# EAGLE design EMG_Final (EAGLE 8.3.2)
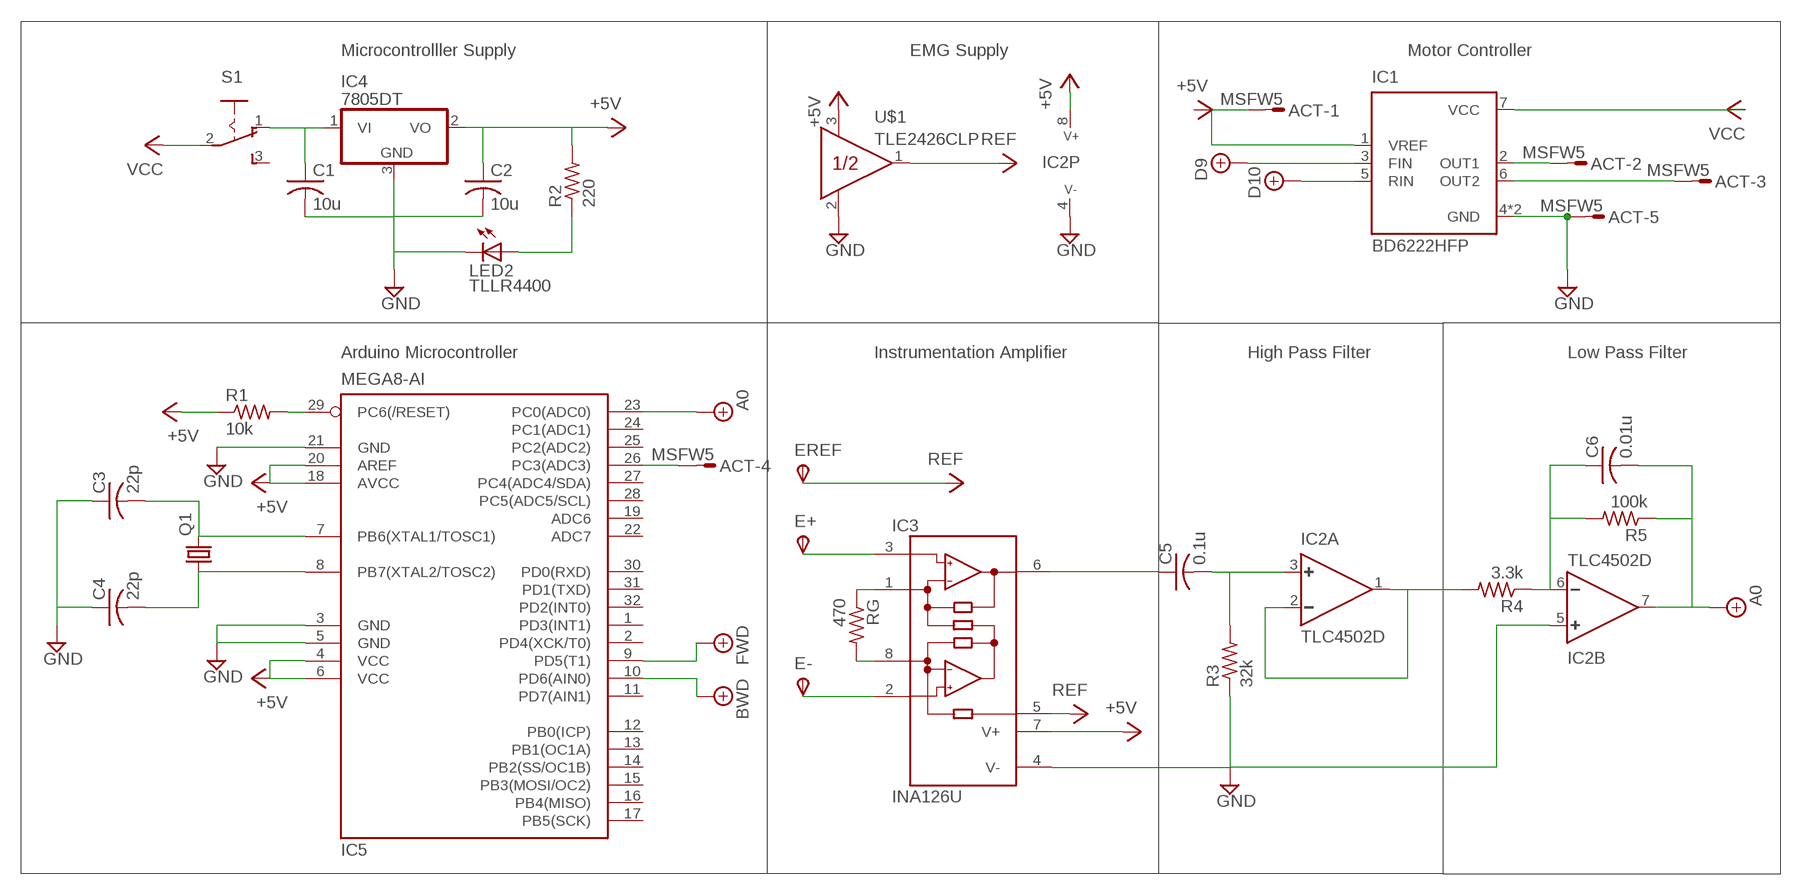
[diagram p0: schematic, sheet 1]

## Parts
ACT  MSFW5  [MSFW5]
C1  10u  C-USC0603  [C0603]
C2  10u  C-USC0603  [C0603]
C3  22p  C-USC0603  [C0603]
C4  22p  C-USC0603  [C0603]
C5  0.1u  C-USC0603  [C0603]
C6  0.01u  C-USC0603  [C0603]
E+  TPSPAD1-13  [P1-13]
E-  TPSPAD1-13  [P1-13]
EREF  TPSPAD1-13  [P1-13]
IC1  BD6222HFP  [HRP7]
IC2  TLC4502D  [D_R-PDSO-G08]
IC3  INA126U  [SO08]
IC4  7805DT  [TO252]
IC5  MEGA8-AI  [TQFP32-08]
LED2  TLLR4400  [LED3MM]
Q1  CRYSTALMM20SS  [MM20SS]
R1  10k  R-US_R0603  [R0603]
R2  220  R-US_R0603  [R0603]
R3  32k  R-US_R0603  [R0603]
R4  3.3k  R-US_R0603  [R0603]
R5  100k  R-US_R0603  [R0603]
RG  470  R-US_R0603  [R0603]
S1  255SB  [255SB]
U$1  TLE2426CLP  [TO226AA]

## Nets
+3V3: EREF.TP(PP) IC3.5(REF) U$1.1(OUT) ; supply symbol labelled REF
+5V: C2.1 IC2.8(P:V+) IC3.7(V+) IC4.2(VO) IC5.4(VCC) IC5.6(VCC) IC5.18(AVCC) IC5.20(AREF) R1.1 R2.2 U$1.3(IN)
+5V/1: C6.2 IC2.7(B:OUT) IC5.23(PC0(ADC0)) R5.1 ; supply symbol labelled A0
+10V: IC1.3(FIN) IC5.9(PD5(T1)) ; supply symbol labelled D9, FWD
+12V: IC1.5(RIN) IC5.10(PD6(AIN0)) ; supply symbol labelled D10, BWD
GND: ACT.5 C1.2 C2.2 C3.1 C4.1 IC1.4(GND) IC1.P(GND) IC2.4(P:V-) IC2.5(B:+) IC3.4(V-) IC4.3(GND) IC5.3(GND) IC5.5(GND) IC5.21(GND) LED2.K(C) R3.1 U$1.2(COM)
N$1: C1.1 IC4.1(VI) S1.1(O)
N$2: C3.2 IC5.7(PB6(XTAL1/TOSC1)) Q1.4
N$3: C4.2 IC5.8(PB7(XTAL2/TOSC2)) Q1.1
N$4: IC5.29(PC6(/RESET)) R1.2
N$5: LED2.A R2.1
N$6: C5.1 IC3.6(OUT)
N$7: C5.2 IC2.3(A:+) R3.2
N$8: IC2.1(A:OUT) IC2.2(A:-) R4.2
N$9: C6.1 IC2.6(B:-) R4.1 R5.2
N$10: ACT.1 IC1.1(VREF)
N$11: IC3.8(RG) RG.2
N$12: IC3.1(RG) RG.1
N$13: ACT.2 IC1.2(OUT1)
N$14: E+.TP(PP) IC3.3(+IN)
N$15: E-.TP(PP) IC3.2(-IN)
N$16: ACT.4 IC5.26(PC3(ADC3))
N$17: ACT.3 IC1.6(OUT2)
VCC: IC1.7(VCC) S1.2(P)
Unconnected: IC5.1(PD3(INT1)) IC5.2(PD4(XCK/T0)) IC5.11(PD7(AIN1)) IC5.12(PB0(ICP)) IC5.13(PB1(OC1A)) IC5.14(PB2(SS/OC1B)) IC5.15(PB3(MOSI/OC2)) IC5.16(PB4(MISO)) IC5.17(PB5(SCK)) IC5.19(ADC6) IC5.22(ADC7) IC5.24(PC1(ADC1)) IC5.25(PC2(ADC2)) IC5.27(PC4(ADC4/SDA)) IC5.28(PC5(ADC5/SCL)) IC5.30(PD0(RXD)) IC5.31(PD1(TXD)) IC5.32(PD2(INT0)) S1.3(S)

## Notes on the sheet
- Microcontrolller Supply | EMG Supply | Motor Controller
- Arduino Microcontroller | Instrumentation Amplifier | High Pass Filter | Low Pass Filter

## Library data of the parts
ACT = con-lumberg:MSFW5: MSF CONNECTOR; OC_FARNELL: unknown; OC_NEWARK: unknown
C1-C6 = resistor:C-US: CAPACITOR, American symbol
E+ E- EREF = testpad:TPS: TEST PIN
IC1 = rohm:BD622*HFP: H-bridge drivers (18V max.) Source: http://www.farnell.com/datasheets/389117.pdf
IC2 = texas:TLC4502: FAMILY OF SELF-CALIBRATING (Self-Cal TM) PRECISION CMOS RAIL-TO-RAIL OUTPUT OPERATIONAL AMPLIFIERS Source: Data sheet <http://www.ti.com/lit/ds/symlink/tlc4502.pdf>
IC3 = burr-brown:INA126: Instrumentation Amplifier Micropower, Single and Dual Versions; MF: TEXAS INSTRUMENTS; MPN: INA126U; OC_FARNELL: 1212409; OC_NEWARK: 84K8003
IC4 = linear:78*: Positive VOLTAGE REGULATOR Source: http://cache.national.com/ds/LM/LM78L05.pdf http://www.fairchildsemi.com/ds/LM/LM7805.pdf
IC5 = atmel:MEGA8: MICROCONTROLLER 8 Kbytes FLASH, 1 kbytes SRAM, 512 bytes EEPROM, USART, 6-channel 10 bit ADC, 2-channel 8 bit ADC Pin compatible with Atmega48, ATMega88, ATMega168 Source: avr.lbr; MPN: ATMEGA8-16AU; OC_FARNELL: 9171371; OC_NEWARK: 73M8863
LED2 = led:TLLR4400: Low Current (2mA) LED 3 mm Tinted Diffused Package color RED Source: Data sheet <http://www.farnell.com/datasheets/391100.pdf>; MF: VISHAY SEMICONDUCTOR; OC_FARNELL: 1612437
Q1 = crystal:CRYSTAL: CRYSTAL; OC_FARNELL: unknown; OC_NEWARK: unknown
R1-R5 RG = resistor:R-US_: RESISTOR, American symbol
S1 = switch:255SB: SLIDING SWITCH Distributor Buerklin, 11G810
U$1 = tle2426:TLE2426*L: Texas Instruments "rail splitter". No noise-reduction pin.

## Board
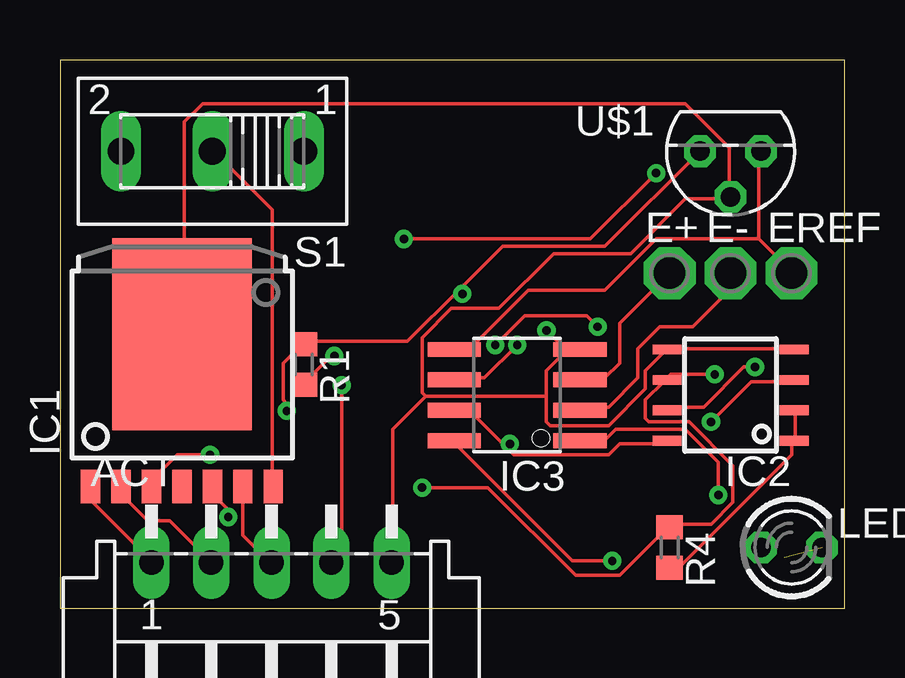
[diagram p1: board, top side]
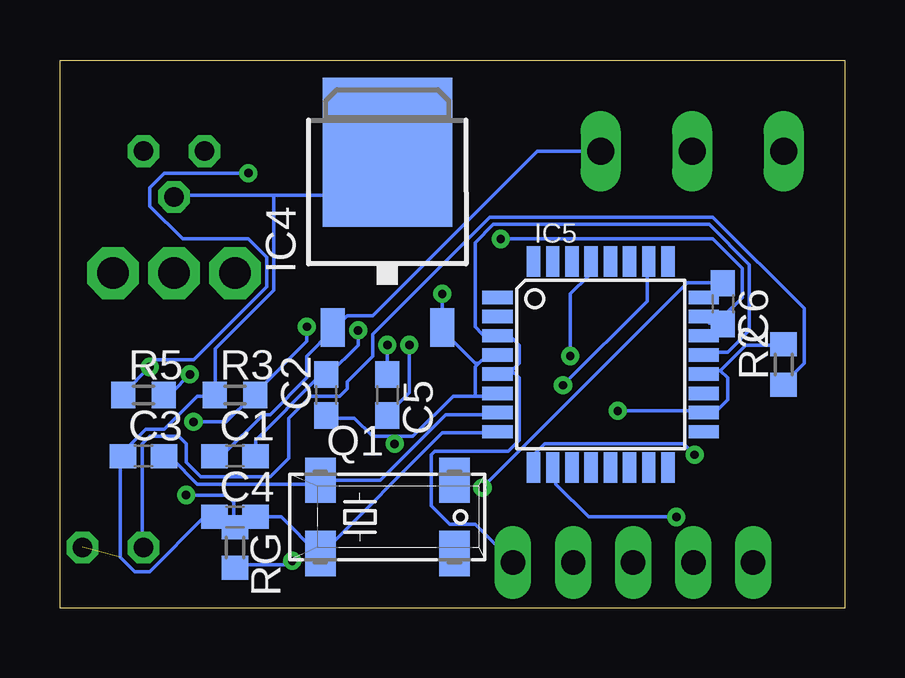
[diagram p2: board, bottom side, seen from below]

Size 32.69 x 22.85 mm. Coordinates in mm from the lower left corner, seen from the top.
Outline: 0,0 32.69,0 32.69,22.85 0,22.85 0,0
Copper layers (1*16): Top 0.035mm / dielectric 1.5mm / Bottom 0.035mm
Design rules "default": minimum track width 6mil, minimum drill 0.35mm, track to track 6mil, track to pad 6mil, pad to pad 6mil, via to via 6mil, smd to smd 6mil, copper to edge 40mil, drill to drill 6mil, minimum pad ring 10mil, minimum via ring 8mil, stop-mask expansion 4mil, vias tented up to drill 0mil, thermal gap 10mil

### Footprints (pad centres in the part's own frame; a part is rotated, then mirrored left to right if it is on the bottom)
MSFW5 = drill 1.016 long: 1 0,1.905; 2 2.489,1.905; 3 5.004,1.905; 4 7.493,1.905; 5 10.008,1.905
C0603 = smd 1.1 x 1: 1 -0.85,0; 2 0.85,0
P1-13 = drill 1.321 pad 2.159 octagon: TP 0,0
HRP7 = smd 0.8 x 1.4: 1 -3.81,-5.08; 2 -2.54,-5.08; 3 -1.27,-5.08; 4 0,-5.08; 5 1.27,-5.08; 6 2.54,-5.08; 7 3.81,-5.08 | smd 5.8 x 8: P 0,1.27
D_R-PDSO-G08 = smd 0.4 x 1.2: 1 -1.905,-2.65; 2 -0.635,-2.65; 3 0.635,-2.65; 4 1.905,-2.65; 5 1.905,2.65; 6 0.635,2.65; 7 -0.635,2.65; 8 -1.905,2.65
SO08 = smd 0.61 x 2.21: 1 -1.905,-2.616; 2 -0.635,-2.616; 3 0.635,-2.616; 4 1.905,-2.616; 5 1.905,2.616; 6 0.635,2.616; 7 -0.635,2.616; 8 -1.905,2.616
TO252 = smd 1 x 1.6: 1 -2.28,-4.8; 2 2.28,-4.8 | smd 5.4 x 6.2: 3 0,2.5
TQFP32-08 = smd 1.27 x 0.559: 1 -4.293,2.8; 2 -4.293,2; 3 -4.293,1.2; 4 -4.293,0.4; 5 -4.293,-0.4; 6 -4.293,-1.2; 7 -4.293,-2; 8 -4.293,-2.8; 17 4.293,-2.8; 18 4.293,-2; 19 4.293,-1.2; 20 4.293,-0.4; 21 4.293,0.4; 22 4.293,1.2; 23 4.293,2; 24 4.293,2.8 | smd 0.559 x 1.27: 9 -2.8,-4.293; 10 -2,-4.293; 11 -1.2,-4.293; 12 -0.4,-4.293; 13 0.4,-4.293; 14 1.2,-4.293; 15 2,-4.293; 16 2.8,-4.293; 25 2.8,4.293; 26 2,4.293; 27 1.2,4.293; 28 0.4,4.293; 29 -0.4,4.293; 30 -1.2,4.293; 31 -2,4.293; 32 -2.8,4.293
LED3MM = drill 0.813 octagon: A -1.27,0; K 1.27,0
MM20SS = smd 1.27 x 1.88: 1 -2.794,-1.524; 2 2.794,-1.524; 3 2.794,1.524; 4 -2.794,1.524
R0603 = smd 1 x 1.1: 1 -0.85,0; 2 0.85,0
255SB = drill 1.118 long: 1 -3.81,0; 2 0,0; 3 3.81,0
TO226AA = drill 0.813 octagon: 1 -1.27,0; 2 0,1.905; 3 1.27,0

### Placement (x,y rotation side)
ACT  3.81,0 0 top
C1  25.4,6.35 0 bottom
C2  21.59,8.89 90 bottom
C3  29.21,6.35 0 bottom
C4  25.4,3.81 0 bottom
C5  19.05,8.89 270 bottom
C6  5.08,12.7 270 bottom
E+  25.4,13.97 0 top
E-  27.94,13.97 0 top
EREF  30.48,13.97 0 top
IC1  5.08,10.16 0 top
IC2  27.94,8.89 90 top
IC3  19.05,8.89 90 top
IC4  19.05,16.51 0 bottom
IC5  10.16,10.16 0 bottom
LED2  30.48,2.54 0 top
Q1  19.05,3.81 0 bottom
R1  10.16,10.16 270 top
R2  2.54,10.16 90 bottom
R3  25.4,8.89 0 bottom
R4  25.4,2.54 270 top
R5  29.21,8.89 0 bottom
RG  25.4,2.54 270 bottom
S1  6.35,19.05 180 top
U$1  27.94,19.05 180 top

### Tracks (layer width: path | path; a pad name or v marks a point on that pad's centre or on a via)
+3V3
  Top 0.152: 29.11,15.39 24.84,15.39 22.71,13.26 19.51,13.26 17.07,10.82 16.46,10.82 IC3.5 | 29.11,15.39 30.48,14.02 EREF.TP | 29.11,15.39 29.11,19.05 U$1.1
+5V  (via drill 0.35)
  Top 0.152: 18.59,6.71 17.07,8.23 16.46,8.23 IC3.7 | 18.59,6.71 18.9,6.4 22.86,6.4 23.32,6.86 25.15,6.86 IC2.8 | 18.59,6.71 v18.75,6.86 | 16.61,13.26 18.44,15.09 22.71,15.09 U$1.3 | 16.61,13.26 14.48,11.12 10.21,11.12 R1.1 10.06,10.97 9.3,10.21 9.3,8.69 9.45,8.53 v9.45,8.23 | 16.61,13.26 v16.76,13.11
  Bottom 0.152: 18.75,7.16 17.98,7.16 16.31,8.84 15.39,8.84 | 18.75,7.16 19.66,7.16 20.42,7.92 21.49,7.92 C2.1 | 15.39,8.84 14.48,8.84 IC5.6 | 15.24,10.21 15.39,10.06 15.39,8.84 | 15.24,10.21 14.94,10.52 14.48,10.52 IC5.4 | 15.24,10.21 15.39,10.21 16.76,11.58 IC4.2 16.76,11.73 v16.76,13.11 | v18.75,6.86 18.75,7.16 | 5.18,9.91 4.12,10.97 2.59,10.97 R2.2 | 5.18,9.91 5.79,9.91 IC5.20 | 5.18,9.91 4.88,9.6 4.88,8.69 5.33,8.23 5.79,8.23 IC5.18 5.94,8.23 v9.45,8.23
+5V/1  (via drill 0.35)
  Top 0.152: v28.96,10.06 28.5,10.06 26.82,8.38 25.3,8.38 IC2.7 | v14.33,15.39 22.1,15.39 v24.84,18.14
  Bottom 0.152: IC5.23 5.79,12.04 5.64,11.89 5.18,11.89 C6.2 5.03,11.89 5.03,12.19 4.27,12.95 4.27,14.17 5.49,15.39 v14.33,15.39 | R5.1 30.02,8.99 v28.96,10.06 28.65,10.36 27.13,10.36 24.08,13.41 24.08,14.63 24.84,15.39 27.58,15.39 28.96,16.76 28.96,17.53 28.35,18.14 v24.84,18.14
+10V  (via drill 0.35)
  Top 0.152: v6.25,6.4 4.88,6.4 3.81,5.33 IC1.3
  Bottom 0.152: v6.25,6.4 6.71,6.86 12.5,6.86 12.95,6.4 12.95,5.94 IC5.9
+12V  (via drill 0.35)
  Top 0.152: v7.01,3.81 7.01,4.12 6.4,4.72 6.4,5.03 IC1.5
  Bottom 0.152: v7.01,3.81 10.67,3.81 12.04,5.18 12.04,5.79 IC5.10
GND  (via drill 0.35)  (1 unrouted)
  Top 0.152: IC2.4 30.48,10.82 25.3,10.82 IC2.5 25.15,10.67 24.38,9.91 24.38,9.14 22.86,7.62 20.42,7.62 20.27,7.77 20.27,8.84 | 21.18,10.67 21.03,10.67 20.27,9.91 20.27,8.84 | 21.18,10.67 21.64,10.67 IC3.4 21.18,10.67 | 15.24,8.84 13.87,7.47 13.87,1.98 ACT.5 | 20.27,8.84 15.24,8.84 | 21.18,10.67 v20.27,11.58 | IC1.P 5.18,11.43 5.18,20.27 5.94,21.03 26.06,21.03 27.89,19.2 27.89,17.22 U$1.2 27.89,17.07 26.06,17.07 23.77,14.78 20.57,14.78 18.29,12.5 16.31,12.5 15.09,11.28 15.09,8.99 15.24,8.84
  Bottom 0.152: IC5.21 5.79,10.67 4.88,10.67 3.96,11.58 3.96,14.33 5.64,16 14.63,16 15.39,15.24 15.39,11.73 15.09,11.43 14.48,11.43 IC5.3 14.33,11.28 13.87,11.28 13.56,10.97 13.56,10.21 13.87,9.91 | 13.87,9.91 14.33,9.91 IC5.5 13.87,9.91 | C1.2 24.54,6.4 24.54,7.01 21.95,9.6 21.64,9.6 C2.2 21.49,9.75 20.27,10.97 v20.27,11.58 | 13.87,9.91 13.56,9.6 13.56,7.01 14.02,6.55 17.07,6.55 17.22,6.4 17.22,4.27 16.46,3.5 15.39,3.5 13.87,1.98 ACT.5 | C4.1 26.67,3.81 28.96,1.52 29.57,1.52 30.18,2.13 30.18,6.25 C3.1 30.18,6.4 29.11,7.47 28.35,7.47 26.98,8.84 26.36,8.84 R3.1 26.21,8.99 26.21,10.82 23.77,13.26 23.77,17.22 | 23.77,17.22 20.73,17.22 19.05,18.9 IC4.3 | 23.77,17.22 27.89,17.22 U$1.2
N$1
  Bottom 0.152: C1.1 26.21,6.4 25.91,6.4 24.23,8.08 23.93,8.08 22.4,9.6 22.4,10.52 21.34,11.58 IC4.1 21.18,11.73 20.73,12.19 19.66,12.19 12.8,19.05 S1.1
N$2
  Bottom 0.152: C3.2 28.35,6.25 28.04,6.25 26.98,5.18 22.1,5.18 21.95,5.33 Q1.4 19.36,5.33 16.61,8.08 14.48,8.08 IC5.7
N$3
  Bottom 0.152: C4.2 23.47,3.81 21.95,2.29 Q1.1 21.79,2.29 16.76,7.32 14.48,7.32 IC5.8
N$4  (via drill 0.35)
  Top 0.152: v11.43,10.52 11.28,10.52 10.21,9.45 R1.2
  Bottom 0.152: v11.43,10.52 11.43,13.11 10.67,13.87 10.67,14.33 IC5.29
N$5
  Bottom 0.152: R2.1 2.44,9.45 1.68,10.21 1.68,12.5 5.49,16.31 14.78,16.31 19.66,11.43 19.66,10.52 20.73,9.45 20.73,9.14 21.03,8.84 22.25,8.84 23.16,7.92 23.16,6.25 23.93,5.49 26.82,5.49 27.43,6.1 27.43,6.86 27.74,7.16 28.96,7.16 29.26,6.86 29.26,2.59 LED2.A
N$6  (via drill 0.35)
  Top 0.152: v19.05,10.97 17.68,9.6 16.46,9.6 IC3.6
  Bottom 0.152: v19.05,10.97 C5.1
N$7  (via drill 0.35)
  Top 0.152: v18.14,10.97 19.36,12.19 21.95,12.19 v22.4,11.73 | v27.13,7.77 28.8,9.45 30.48,9.45 IC2.3
  Bottom 0.152: v18.14,10.97 18.14,8.99 19.05,8.08 C5.2 | v22.4,11.73 22.4,11.12 24.54,8.99 R3.2 24.69,8.84 25.76,7.77 v27.13,7.77
N$8
  Top 0.152: R4.2 25.45,1.83 25.91,1.83 30.48,6.4 30.48,6.86 IC2.1 30.63,7.01 30.63,8.23 IC2.2
N$9  (via drill 0.35)
  Top 0.152: v15.09,5.03 17.83,5.03 21.49,1.37 23.32,1.37 25.3,3.35 R4.1 25.45,3.5 27.13,3.5 28.04,4.42 28.04,5.94 26.21,7.77 24.54,7.77 24.38,7.92 24.38,8.69 25.15,9.45 IC2.6 25.3,9.6 25.45,9.75 v27.28,9.75
  Bottom 0.152: v15.09,5.03 6.55,13.56 5.18,13.56 C6.1 | v27.28,9.75 28.04,8.99 28.35,8.99 R5.2
N$10
  Top 0.152: IC1.1 1.37,5.03 1.37,4.42 3.81,1.98 ACT.1
N$11  (via drill 0.35)
  Top 0.152: v23.01,1.98 21.34,1.98 16.46,6.86 IC3.8
  Bottom 0.152: v23.01,1.98 23.16,1.83 25.3,1.83 RG.2
N$12  (via drill 0.35)
  Top 0.152: v27.43,4.72 27.43,6.1 26.06,7.47 23.16,7.47 22.71,7.01 21.79,7.01 IC3.1
  Bottom 0.152: v27.43,4.72 25.76,4.72 25.45,4.42 25.45,3.5 RG.1
N$13
  Top 0.152: IC1.2 2.59,5.03 2.59,4.72 3.66,3.66 4.57,3.66 6.25,1.98 ACT.2
N$14
  Top 0.152: E+.TP 23.32,11.89 23.32,10.21 22.71,9.6 21.79,9.6 IC3.3
N$15
  Top 0.152: IC3.2 21.79,8.38 22.86,8.38 24.08,9.6 24.08,10.82 24.99,11.73 26.36,11.73 27.89,13.26 27.89,13.87 E-.TP
N$16  (via drill 0.35)
  Top 0.152: v11.73,9.3 11.73,2.29 11.43,1.98 ACT.4
  Bottom 0.152: v11.73,9.3 8.23,12.8 8.23,14.33 IC5.26
N$17
  Top 0.152: IC1.6 7.62,3.05 8.69,1.98 ACT.3
VCC
  Top 0.152: IC1.7 8.84,5.18 8.84,16.61 6.4,19.05 S1.2